# EasyEDA schematic SCH_Self-balancing_2024-06-14.json
TITLE: Sheet_1; REV: 1.0; Date: 2019-09-04; Sheet: 1/1; Drawn By: sharmaz747; Company: Your Company
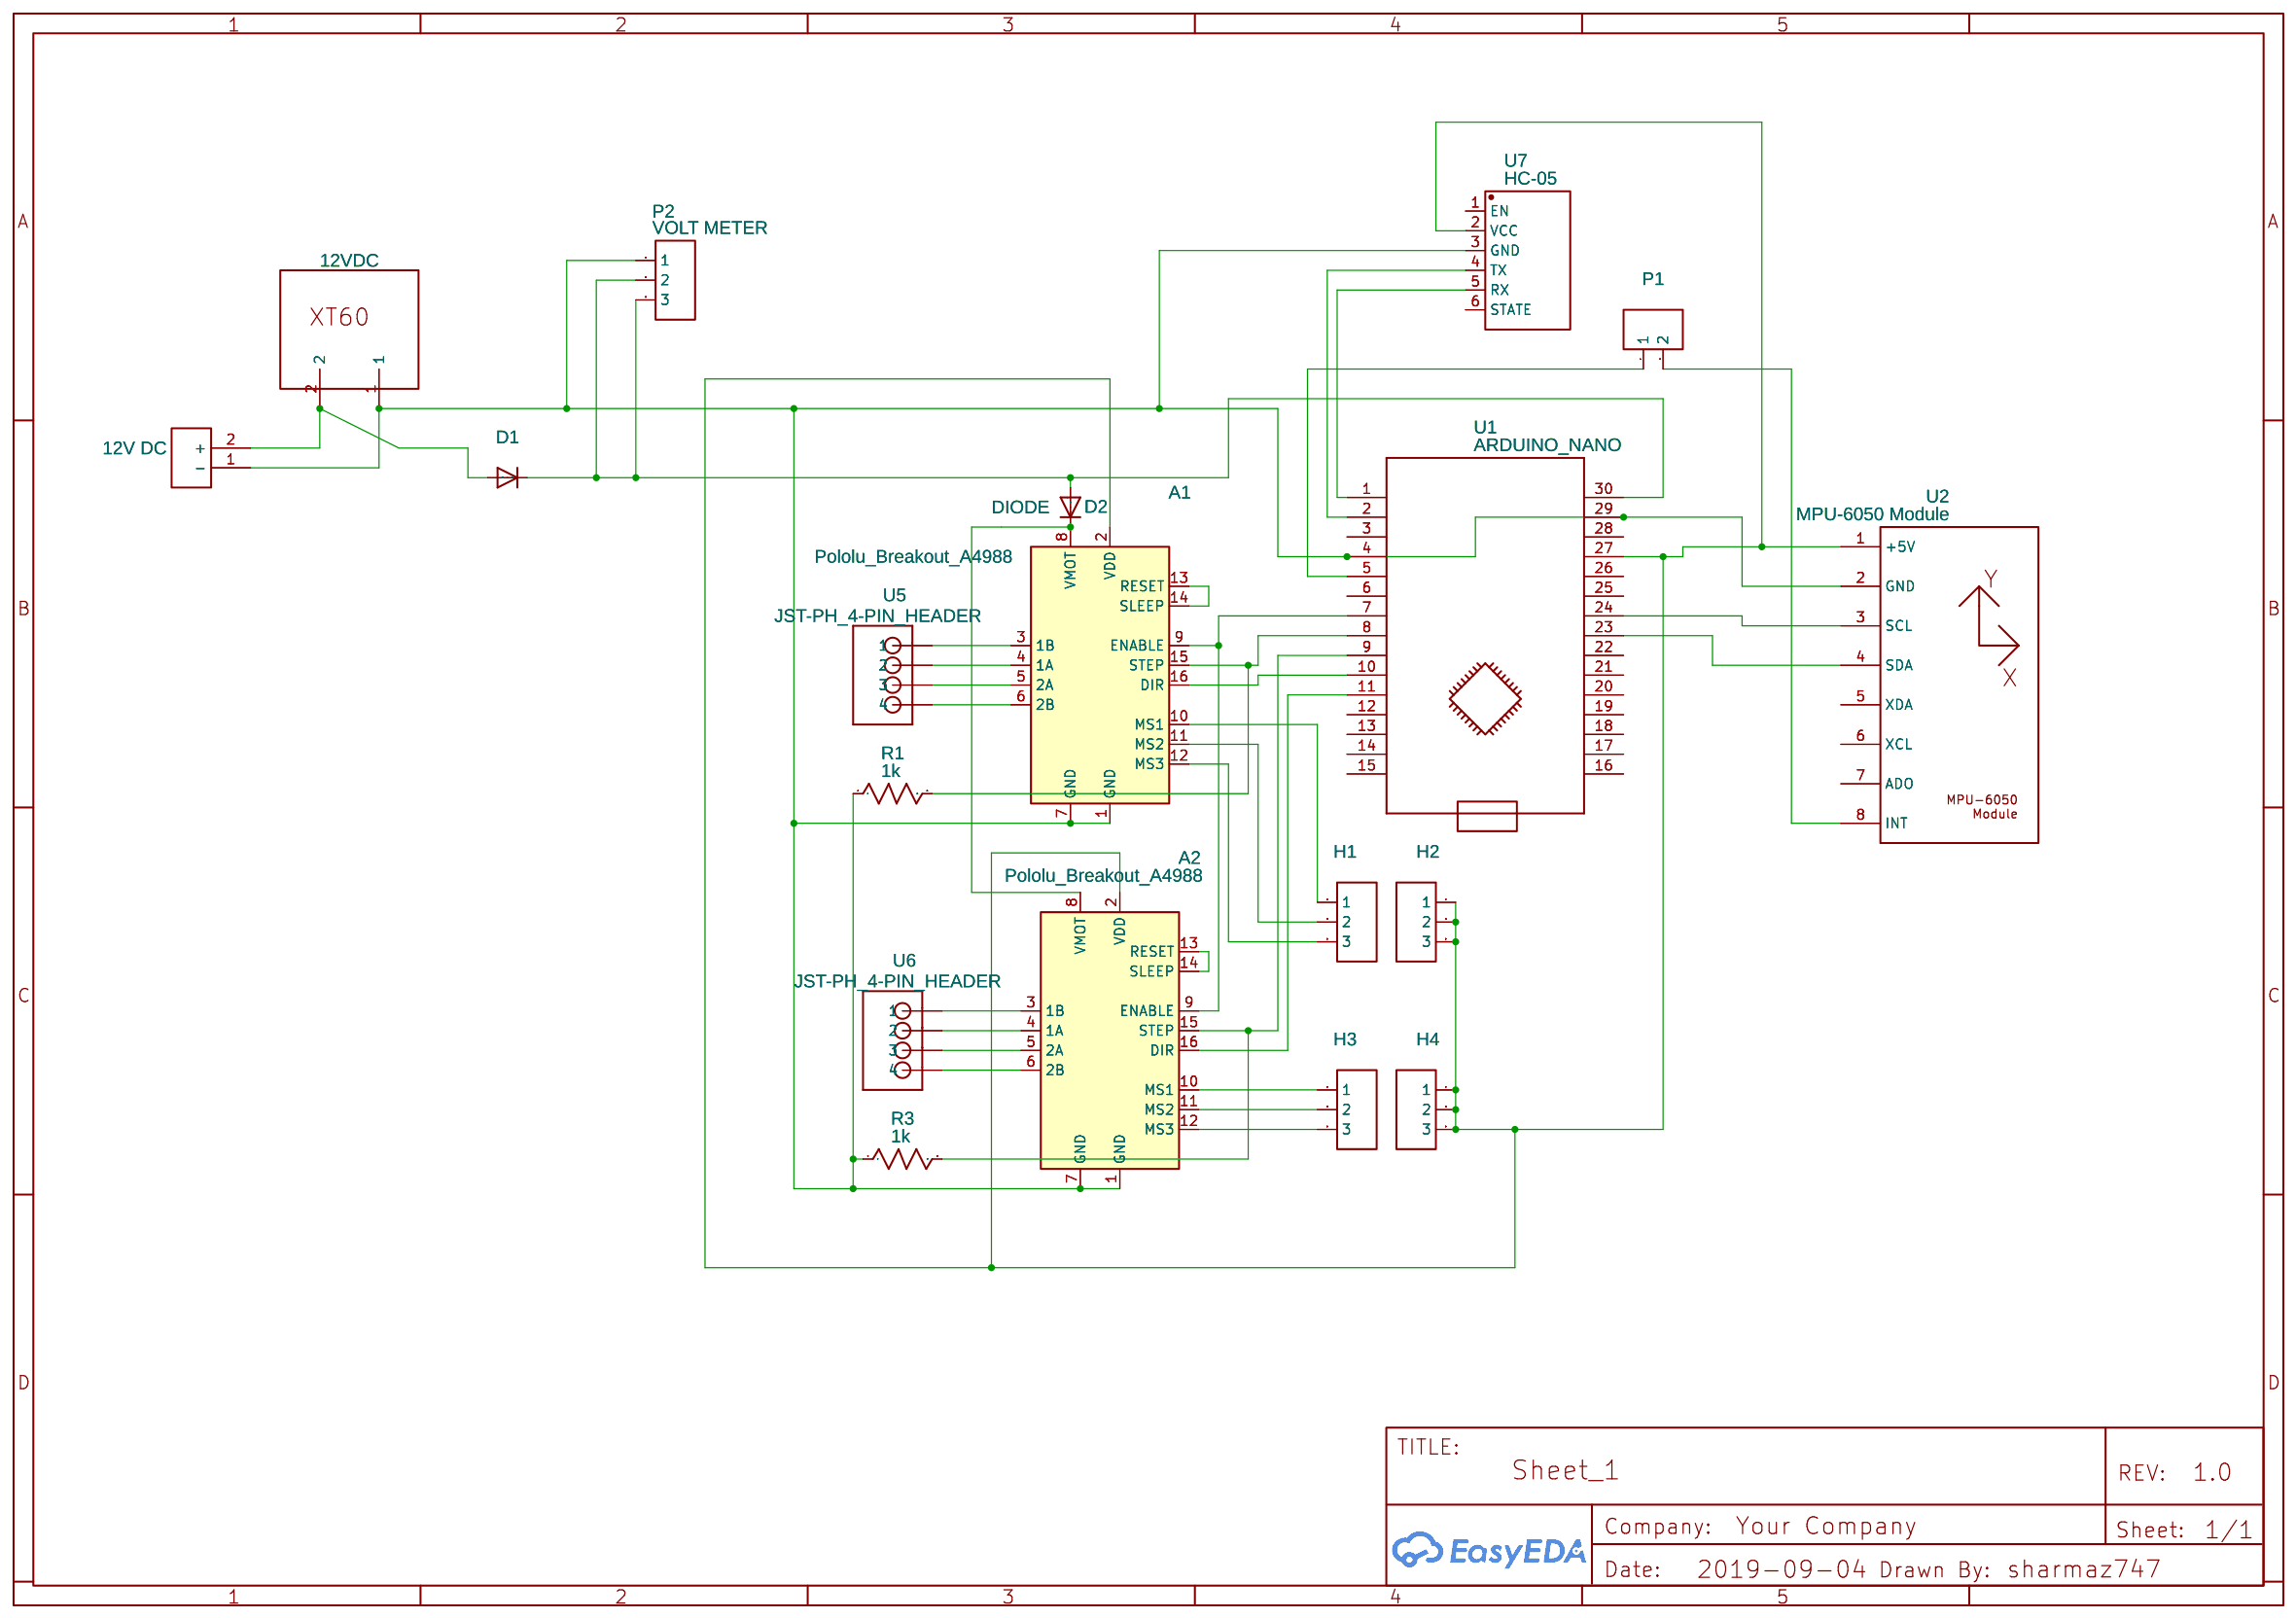
[diagram p0: schematic sheet]

## Parts
12VDC  XT60  [XT60]
24VDC  12V DC  [SCREW_TERMINAL_5.08MM_2P_ANGLED]
A1  Pololu_Breakout_A4988  [POLOLU_BREAKOUT-16_15.2X20.3MM]
A2  Pololu_Breakout_A4988  [POLOLU_BREAKOUT-16_15.2X20.3MM]
D1  DIODE  [DIODE-1N4001-KIT]
D2  DIODE  [DIODE-1N4001-KIT]
H1  Header-Male-2.54_1x3  [HDR-TH_3P-P2.54-V]
H2  Header-Male-2.54_1x3  [HDR-TH_3P-P2.54-V]
H3  Header-Male-2.54_1x3  [HDR-TH_3P-P2.54-V]
H4  Header-Male-2.54_1x3  [HDR-TH_3P-P2.54-V]
P1  Header-Female-2.54_1x2  [HDR-1X2/2.54]
P2  VOLT METER  [HDR-3X1/2.54]
R1  1k  [AXIAL-0.3]
R3  1k  [AXIAL-0.3]
U1  ARDUINO_NANO  [ARDUINO_NANO]
U2  MPU-6050 Module  [MPU-6050 MODULE]
U5  JST-PH_4-PIN_HEADER  [JST_B4B-PH_HEADER]
U6  JST-PH_4-PIN_HEADER  [JST_B4B-PH_HEADER]
U7  HC-05  [HC-05]

## Library data of the parts
12VDC = -: Contributor: Drone_H2EA
24VDC = -: Manufacturer Part: SCREW TERMINAL 6P .2; Contributor: milkomax
A1 A2 = -: Contributor: KiCAD; license: https://www.gnu.org/licenses/lgpl-2.1.html
D1 D2 = -: Contributor: SparkFun
H1-H4 = -: Supplier: LCSC; Manufacturer: BOOMELE; Manufacturer Part: Header2.54mm 1*3P; image: //image.lceda.cn/szlcsc/C49257.jpg; Supplier Part: C49257
P1 = -: Supplier: LCSC; Manufacturer: BOOMELE; Manufacturer Part: 2.54-1*2PFemale; image: //image.lceda.cn/szlcsc/C49661.jpg; Supplier Part: C49661
P2 = -: Supplier Part: C146243; Supplier: LCSC; Manufacturer: Boom Precision Elec; Manufacturer Part: Header-Female-2.54_1x3; link: https://datasheet.lcsc.com/szlcsc/Boom-Precision-Elec-2-54mm-1-8P-Straight-Female-header_C27438.pdf
R1 R3 = Res_AXIAL-0.3(1/8W)_US
U1 = -: sourceId: KGSeAWhDB
U2 = -: Contributor: davidg; sourceId: vtnFWQ8qI

## Nets
Net-(12VDC-1): 12VDC.1 24VDC.1(-) A1.1(GND) A1.7(GND) A2.1(GND) A2.7(GND) P2.1 R1.1 R3.1 U1.4 U1.29 U2.2(GND) U7.3(GND)
Net-(12VDC-2): 12VDC.2 24VDC.2(+) D1.A
Net-(A1-2): A1.2(VDD) A2.2(VDD) H2.1 H2.2 H2.3 H4.1 H4.2 H4.3 U1.27 U2.1(+5V) U7.2(VCC)
Net-(A1-3): A1.3(1B) U5.P1(1)
Net-(A1-4): A1.4(1A) U5.P2(2)
Net-(A1-5): A1.5(2A) U5.P3(3)
Net-(A1-6): A1.6(2B) U5.P4(4)
Net-(A1-8): A1.8(VMOT) A2.8(VMOT) D2.C
Net-(A1-9): A1.9(ENABLE) A2.9(ENABLE) U1.7
Net-(A1-10): A1.10(MS1) H1.1
Net-(A1-11): A1.11(MS2) H1.2
Net-(A1-12): A1.12(MS3) H1.3
Net-(A1-13): A1.13(RESET) A1.14(SLEEP)
Net-(A1-15): A1.15(STEP) R1.2 U1.8
Net-(A1-16): A1.16(DIR) U1.10
Net-(A2-3): A2.3(1B) U6.P1(1)
Net-(A2-4): A2.4(1A) U6.P2(2)
Net-(A2-5): A2.5(2A) U6.P3(3)
Net-(A2-6): A2.6(2B) U6.P4(4)
Net-(A2-10): A2.10(MS1) H3.1
Net-(A2-11): A2.11(MS2) H3.2
Net-(A2-12): A2.12(MS3) H3.3
Net-(A2-13): A2.13(RESET) A2.14(SLEEP)
Net-(A2-15): A2.15(STEP) R3.2 U1.9
Net-(A2-16): A2.16(DIR) U1.11
Net-(D1-C): D1.C D2.A P2.2 P2.3 U1.30
Net-(P1-1): P1.1 U1.5
Net-(P1-2): P1.2 U2.8(INT)
Net-(U1-1): U1.1 U7.5(RX)
Net-(U1-2): U1.2 U7.4(TX)
Net-(U1-23): U1.23 U2.4(SDA)
Net-(U1-24): U1.24 U2.3(SCL)

Not connected (* = marked no-connect by the designer): U1 3 6 12 13 14 15 16 17 18 19 20 21 22 25 26 28; U2 5(XDA) 6(XCL) 7(ADO); U7 1(EN) 6(STATE)
